# Altium schematic sheet программатор_ПЛИС.SchDoc
size 420 x 297 mm; SheetNumber: 6; SheetTotal: 6
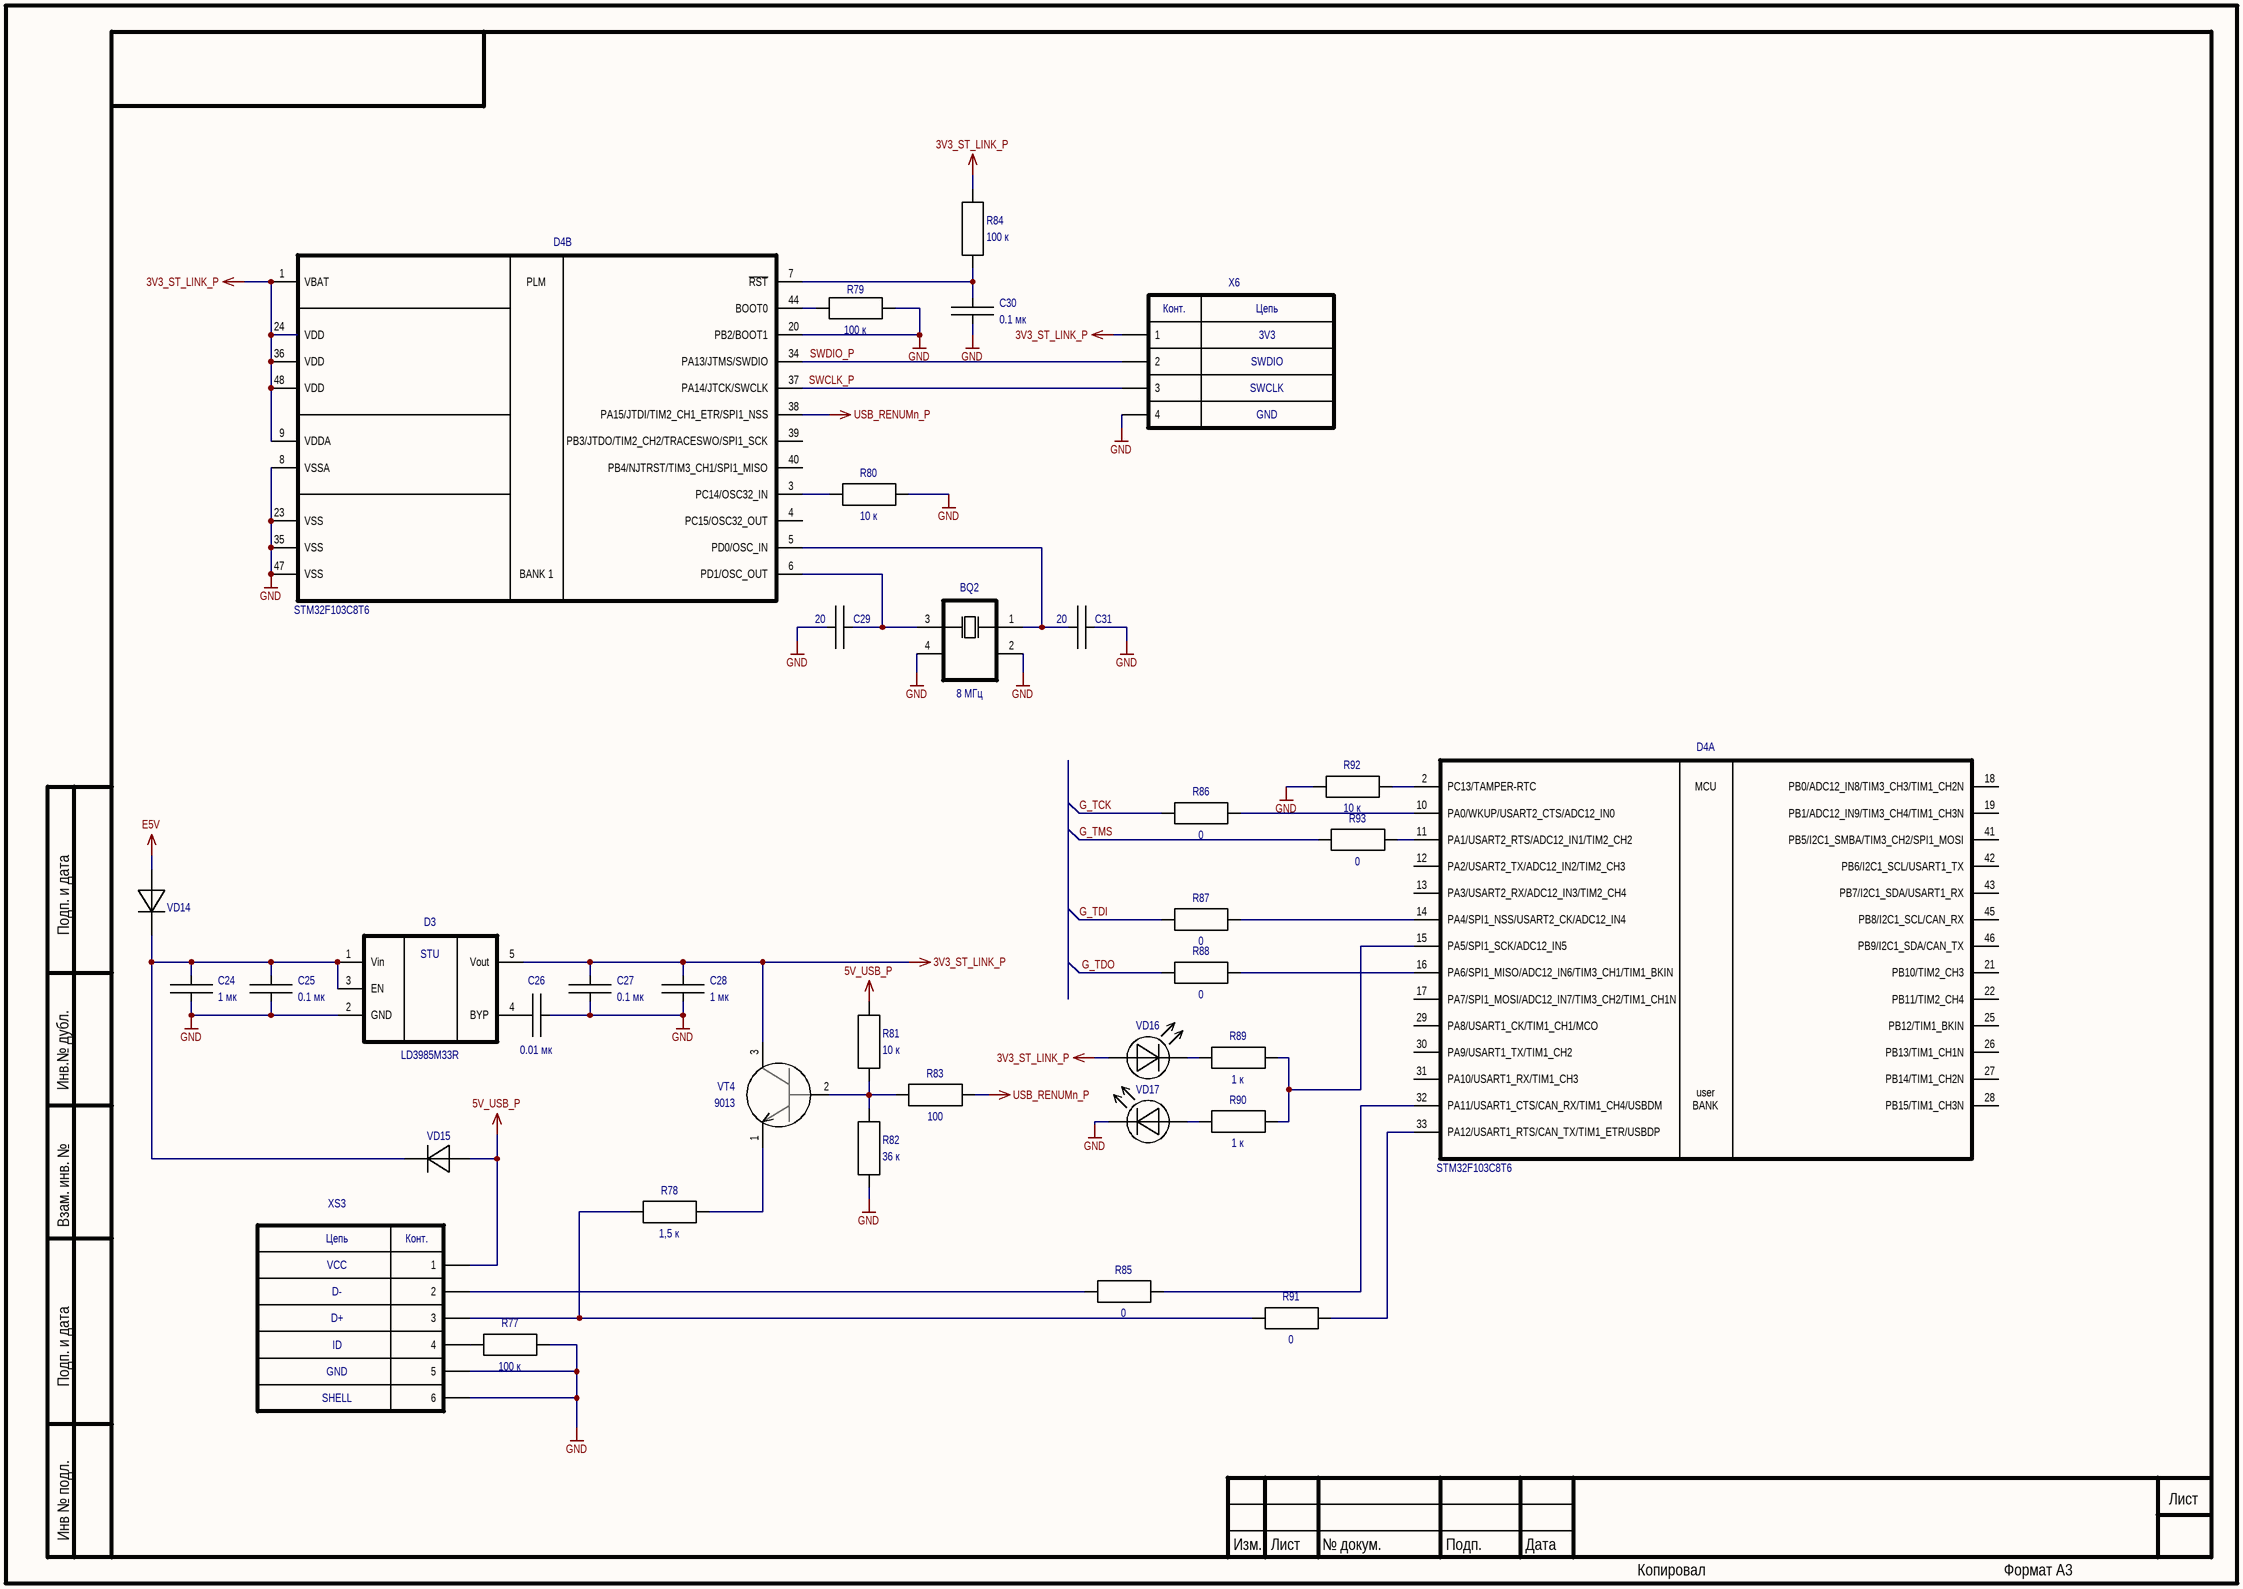
[diagram p0: программатор_ПЛИС.SchDoc]

## Parts
BQ2  value 8 МГц  [SMD3225_4P20MHZ20PF10PPM]  (hidden comment: кварцевый резонатор_1)
C24  value 1 мк  (hidden comment: 1 мкФ ±* * * *, *)
C25  value 0.1 мк  (hidden comment: 0.1 мкФ ±* * * *, *)
C26  value 0.01 мк  [K10-79_1.6_0.8(0603)]  (hidden comment: 0.01 мкФ ±* * * *, *)
C27  value 0.1 мк  (hidden comment: 0.1 мкФ ±* * * *, *)
C28  value 1 мк  (hidden comment: 1 мкФ ±* * * *, *)
C29  value 20  (hidden comment: 20Ф ±* * * *, *)
C30  value 0.1 мк  (hidden comment: 0.1 мкФ ±* * * *, *)
C31  value 20  (hidden comment: 20Ф ±* * * *, *)
D3  value LD3985M33R  [SOT-23-5]  (hidden comment: LT1761ES5-2.5 (TSOT-23) Linear Technology)
D4  value STM32F103C8T6  [LQFP48]  (parts A,B of 2)
R77  value 100 к
R78  value 1,5 к
R79  value 100 к
R80  value 10 к
R81  value 10 к
R82  value 36 к
R83  value 100
R84  value 100 к  [RES 0603]
R85  value 0
R86  value 0
R87  value 0
R88  value 0
R89  value 1 к
R90  value 1 к
R91  value 0
R92  value 10 к
R93  value 0
VD14  BAS316  [SOD323]  (value not drawn)
VD15  BAS316  [SOD-323]  (value not drawn)
VD16  Светодиод  [LED 0603]  (value not drawn)
VD17  Светодиод  [LED 0603]  (value not drawn)
VT4  value 9013  [SOT23(KT-46)]  (hidden comment: BC847C (SOT-23) NXP)
X6  1: 3V3  2: SWDIO  3: SWCLK  4: GND  (hidden comment: KONT_POLE_4)
XS3  1: VCC  3: D+  2: D-  4: ID  6: SHELL  5: GND  [micro_USB]  (hidden comment: KONT_POLE_USB_DBG)

## Nets
3V3_ST_LINK_P: C27.2 C28.2 D3.5(Vout) D4.1(VBAT) D4.9(VDDA) D4.24(VDD) D4.36(VDD) D4.48(VDD) R84.1 VD16.1(A) VT4.3 X6.1
5V_USB_P: R81.1 VD15.1 XS3.1
E5V: VD14.1
GND: BQ2.2(GND) BQ2.4(GND) C24.1 C25.1 C26.1 C27.1 C28.1 C29.2 C30.2 C31.1 D3.2(GND) D4.8(VSSA) D4.20(PB2/BOOT1) D4.23(VSS) D4.35(VSS) D4.47(VSS) R77.2 R79.2 R80.1 R82.2 R92.1 VD17.2(C) X6.4 XS3.5 XS3.6
USB_RENUMn_P: D4.38(PA15/JTDI/TIM2_CH1_ETR/SPI1_NSS) R83.2
G_TCK: R86.1
G_TDI: R87.1
G_TDO: R88.1
G_TMS: R93.1
SWCLK_P: D4.37(PA14/JTCK/SWCLK) X6.3
SWDIO_P: D4.34(PA13/JTMS/SWDIO) X6.2
NetBQ2_1: BQ2.1 C31.2 D4.5(PD0/OSC_IN)
NetBQ2_3: BQ2.3 C29.1 D4.6(PD1/OSC_OUT)
NetC24_2: C24.2 C25.2 D3.1(Vin) D3.3(EN) VD14.2 VD15.2
NetC26_2: C26.2 D3.4(BYP)
NetC30_1: C30.1 D4.7(~{RST}) R84.2
NetD4_2: D4.2(PC13/TAMPER-RTC) R92.2
NetD4_3: D4.3(PC14/OSC32_IN) R80.2
NetD4_10: D4.10(PA0/WKUP/USART2_CTS/ADC12_IN0) R86.2
NetD4_11: D4.11(PA1/USART2_RTS/ADC12_IN1/TIM2_CH2) R93.2
NetD4_14: D4.14(PA4/SPI1_NSS/USART2_CK/ADC12_IN4) R87.2
NetD4_15: D4.15(PA5/SPI1_SCK/ADC12_IN5) R89.2 R90.2
NetD4_16: D4.16(PA6/SPI1_MISO/ADC12_IN6/TIM3_CH1/TIM1_BKIN) R88.2
NetD4_32: D4.32(PA11/USART1_CTS/CAN_RX/TIM1_CH4/USBDM) R85.2
NetD4_33: D4.33(PA12/USART1_RTS/CAN_TX/TIM1_ETR/USBDP) R91.2
NetD4_44: D4.44(BOOT0) R79.1
NetR77_1: R77.1 XS3.4
NetR78_1: R78.1 R91.1 XS3.3
NetR78_2: R78.2 VT4.1
NetR81_2: R81.2 R82.1 R83.1 VT4.2
NetR85_1: R85.1 XS3.2
NetR89_1: R89.1 VD16.2(C)
NetR90_1: R90.1 VD17.1(A)

Not connected (* = marked no-connect by the designer): D4 4(PC15/OSC32_OUT) 12(PA2/USART2_TX/ADC12_IN2/TIM2_CH3) 13(PA3/USART2_RX/ADC12_IN3/TIM2_CH4) 17(PA7/SPI1_MOSI/ADC12_IN7/TIM3_CH2/TIM1_CH1N) 18(PB0/ADC12_IN8/TIM3_CH3/TIM1_CH2N) 19(PB1/ADC12_IN9/TIM3_CH4/TIM1_CH3N) 21(PB10/TIM2_CH3) 22(PB11/TIM2_CH4) 25(PB12/TIM1_BKIN) 26(PB13/TIM1_CH1N) 27(PB14/TIM1_CH2N) 28(PB15/TIM1_CH3N) 29(PA8/USART1_CK/TIM1_CH1/MCO) 30(PA9/USART1_TX/TIM1_CH2) 31(PA10/USART1_RX/TIM1_CH3) 39(PB3/JTDO/TIM2_CH2/TRACESWO/SPI1_SCK) 40(PB4/NJTRST/TIM3_CH1/SPI1_MISO) 41(PB5/I2C1_SMBA/TIM3_CH2/SPI1_MOSI) 42(PB6/I2C1_SCL/USART1_TX) 43(PB7/I2C1_SDA/USART1_RX) 45(PB8/I2C1_SCL/CAN_RX) 46(PB9/I2C1_SDA/CAN_TX)

## Notes on the sheet
- Подп. и дата
- Инв.№ дубл.
- Взам. инв. №
- Инв № подл.
- Изм.
- Лист
- № докум.
- Подп.
- Дата
- Копировал
- Формат А3
- (in symbol KONT_POLE_4) Конт.; Цепь
- (in symbol KONT_POLE_USB_DBG) Цепь; Конт.
- (in symbol LD3985M33R) STU
- (in symbol stm32f103c8t6, part A) MCU; user; BANK
- (in symbol stm32f103c8t6, part B) PLM; BANK 1

## Library data of the parts
BQ2 = кварцевый резонатор_1: PartNumber: MQ-12.000-18; Company: Mercury; Package: 0705
C24-C31 = C: Company: *; PartNumber: *; Tolerance: *; Voltage: *; Type: *; Package: *
D3 = LD3985M33R: Company: Linear Technology; PartNumber: LT1761ES5-2.5; Package: TSOT-23
D4 = stm32f103c8t6: Company: Xilinx; PurtNamber: XC6SLX25-2FGG484C; Package: LQFP-48
R77-R80 R83 R85-R93 = R: Company: *; PartNumber: *; Package: *; Tolerance: *
R81 R82 R84 = R_1: Company: *; PartNumber: *; Package: *; Tolerance: *
VD14 VD15 = BAS316: Company: NXP; PartNumber: BAS316; Package: SOD-323; Value: BAS316
VT4 = T!9013: Package: SOT-23; PartNumber: BC847C; Company: NXP